# EAGLE design ESP8266_breadboard (EAGLE 6.1)
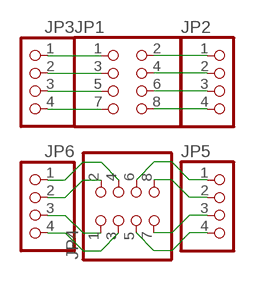
[diagram p0: schematic, sheet 1]

## Parts
JP1  PINHD-2X4  [2X04]
JP2  PINHD-1X4  [1X04]
JP3  PINHD-1X4  [1X04]
JP4  PINHD-2X4  [2X04]
JP5  PINHD-1X4  [1X04]
JP6  PINHD-1X4  [1X04]

## Nets
N$1: JP1.2 JP2.1
N$2: JP1.4 JP2.2
N$3: JP1.6 JP2.3
N$4: JP1.8 JP2.4
N$5: JP1.1 JP3.1
N$6: JP1.3 JP3.2
N$7: JP1.5 JP3.3
N$8: JP1.7 JP3.4
N$9: JP4.2 JP6.2
N$10: JP4.4 JP6.1
N$11: JP4.1 JP6.3
N$12: JP4.3 JP6.4
N$13: JP4.8 JP5.2
N$14: JP4.7 JP5.3
N$15: JP4.6 JP5.1
N$16: JP4.5 JP5.4

## Library data of the parts
JP1 JP4 = pinhead:PINHD-2X4: PIN HEADER
JP2 JP3 JP5 JP6 = pinhead:PINHD-1X4: PIN HEADER

## Board
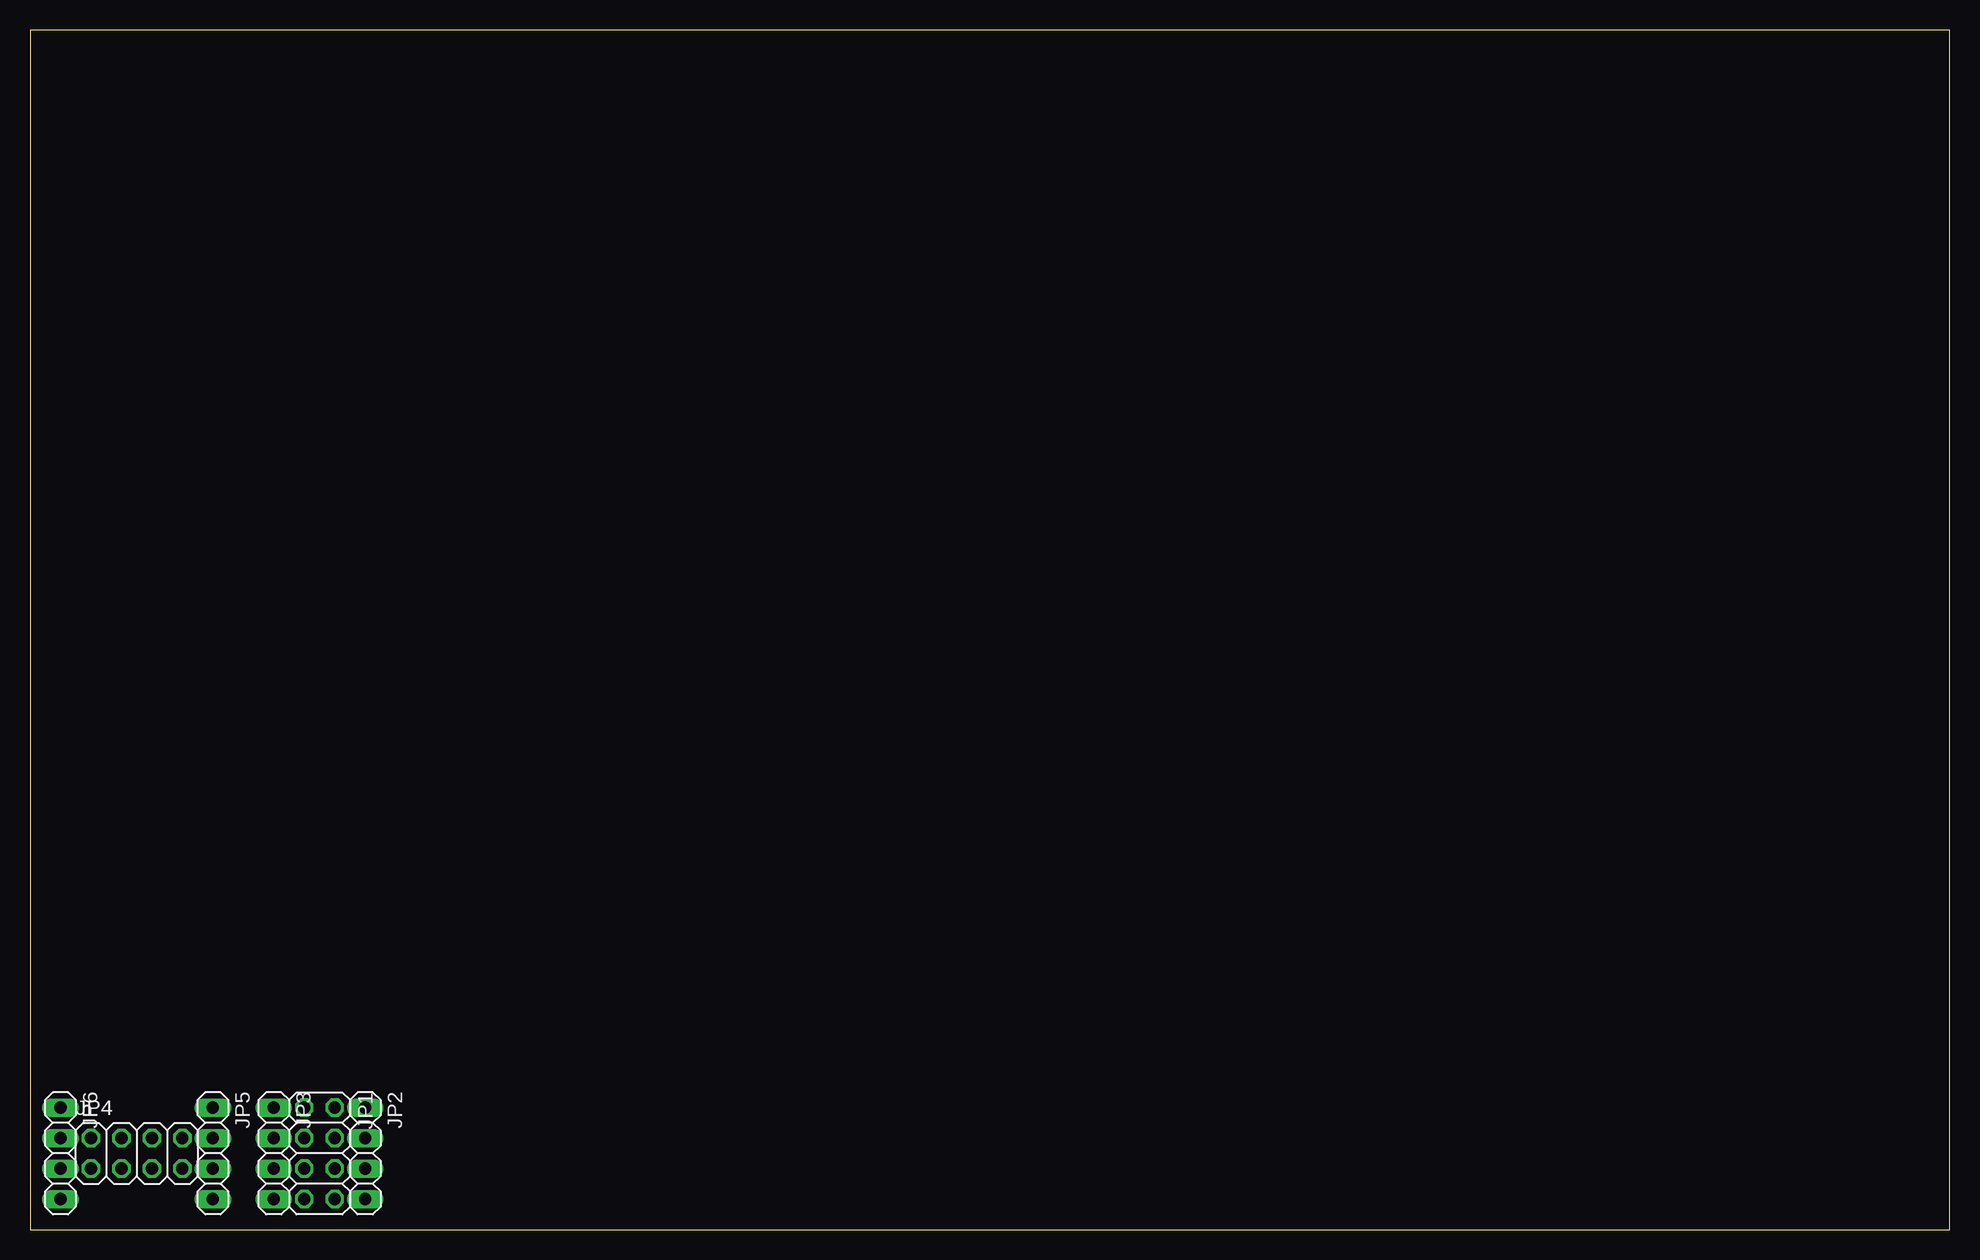
[diagram p1: board, top side]
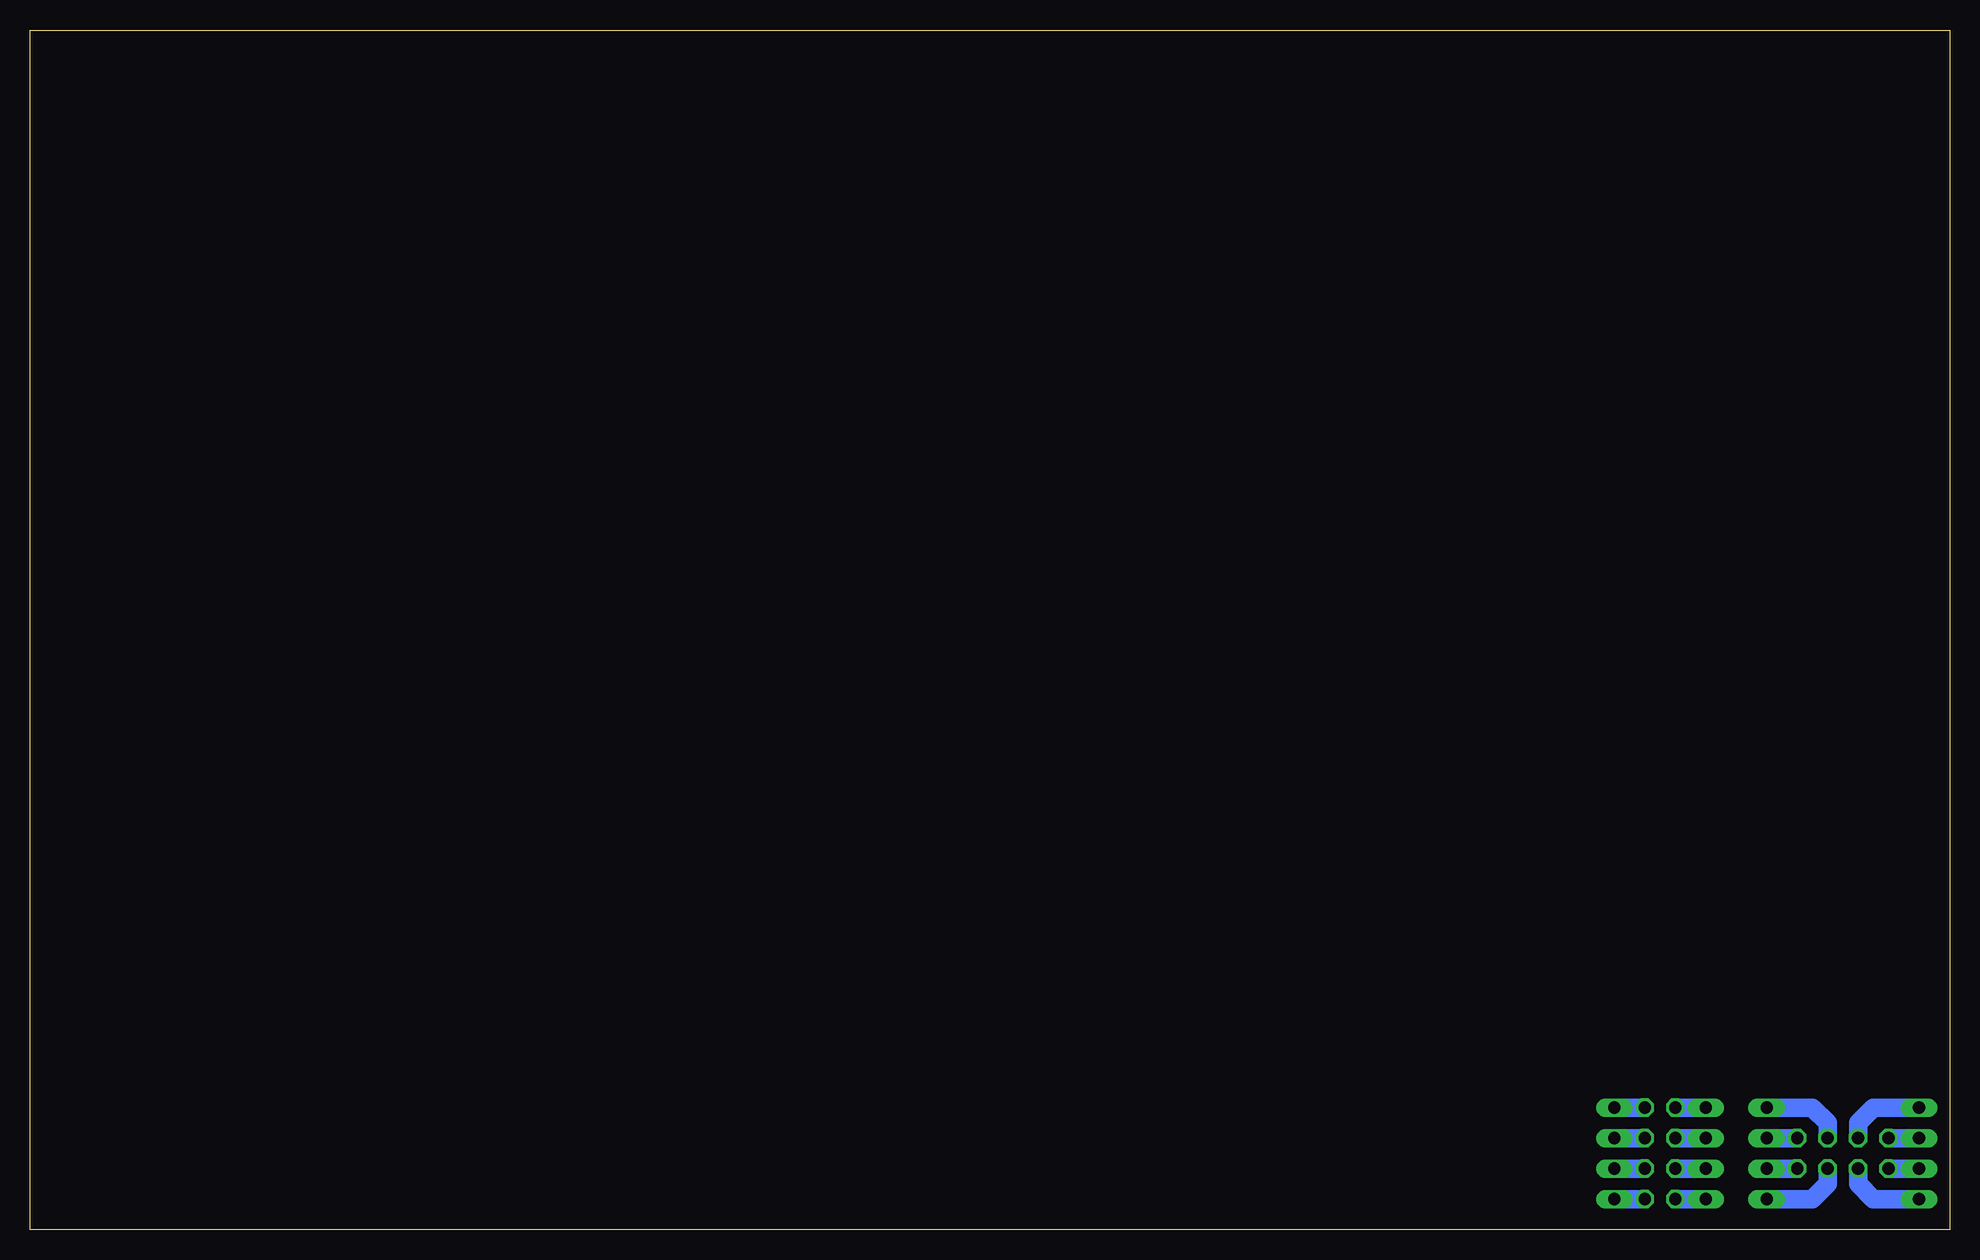
[diagram p2: board, bottom side, seen from below]

Size 160 x 100 mm. Coordinates in mm from the lower left corner, seen from the top.
Outline: 0,0 160,0 160,100 0,100 0,0
Copper layers (1*16): Top 0.035mm / dielectric 1.5mm / Bottom 0.035mm
Design rules: minimum track width 10mil, minimum drill 24mil, track to track 12mil, track to pad 12mil, pad to pad 12mil, via to via 12mil, smd to smd 10mil, copper to edge 12mil, drill to drill 12mil, minimum pad ring 10mil, minimum via ring 10mil, stop-mask expansion 4mil, vias tented up to drill 0mil, thermal gap 12mil

### Footprints (pad centres in the part's own frame; a part is rotated, then mirrored left to right if it is on the bottom)
2X04 = drill 1.016 octagon: 1 -3.81,-1.27; 2 -3.81,1.27; 3 -1.27,-1.27; 4 -1.27,1.27; 5 1.27,-1.27; 6 1.27,1.27; 7 3.81,-1.27; 8 3.81,1.27
1X04 = drill 1.016 long: 1 -3.81,0; 2 -1.27,0; 3 1.27,0; 4 3.81,0

### Placement (x,y rotation side)
JP1  24.13,6.35 270 top
JP2  27.94,6.35 270 top
JP3  20.32,6.35 270 top
JP4  8.89,6.35 0 top
JP5  15.24,6.35 270 top
JP6  2.54,6.35 270 top

### Tracks (layer width: path | path; a pad name or v marks a point on that pad's centre or on a via)
N$1
  Bottom 1.524: JP1.2 JP2.1
N$2
  Bottom 1.524: JP1.4 JP2.2
N$3
  Bottom 1.524: JP1.6 JP2.3
N$4
  Bottom 1.524: JP1.8 JP2.4
N$5
  Bottom 1.524: JP3.1 JP1.1
N$6
  Bottom 1.524: JP3.2 JP1.3
N$7
  Bottom 1.524: JP3.3 JP1.5
N$8
  Bottom 1.524: JP3.4 JP1.7
N$9
  Bottom 1.524: JP6.2 JP4.2
N$10
  Bottom 1.524: JP6.1 6.35,10.16 7.62,8.89 JP4.4
N$11
  Bottom 1.524: JP6.3 JP4.1
N$12
  Bottom 1.524: JP6.4 6.35,2.54 7.62,3.81 JP4.3
N$13
  Bottom 1.524: JP4.8 JP5.2
N$14
  Bottom 1.524: JP4.7 JP5.3
N$15
  Bottom 1.524: JP5.1 11.43,10.16 10.16,8.89 JP4.6
N$16
  Bottom 1.524: JP5.4 11.43,2.54 10.16,3.81 JP4.5